# EAGLE design working (EAGLE 6.5.0)
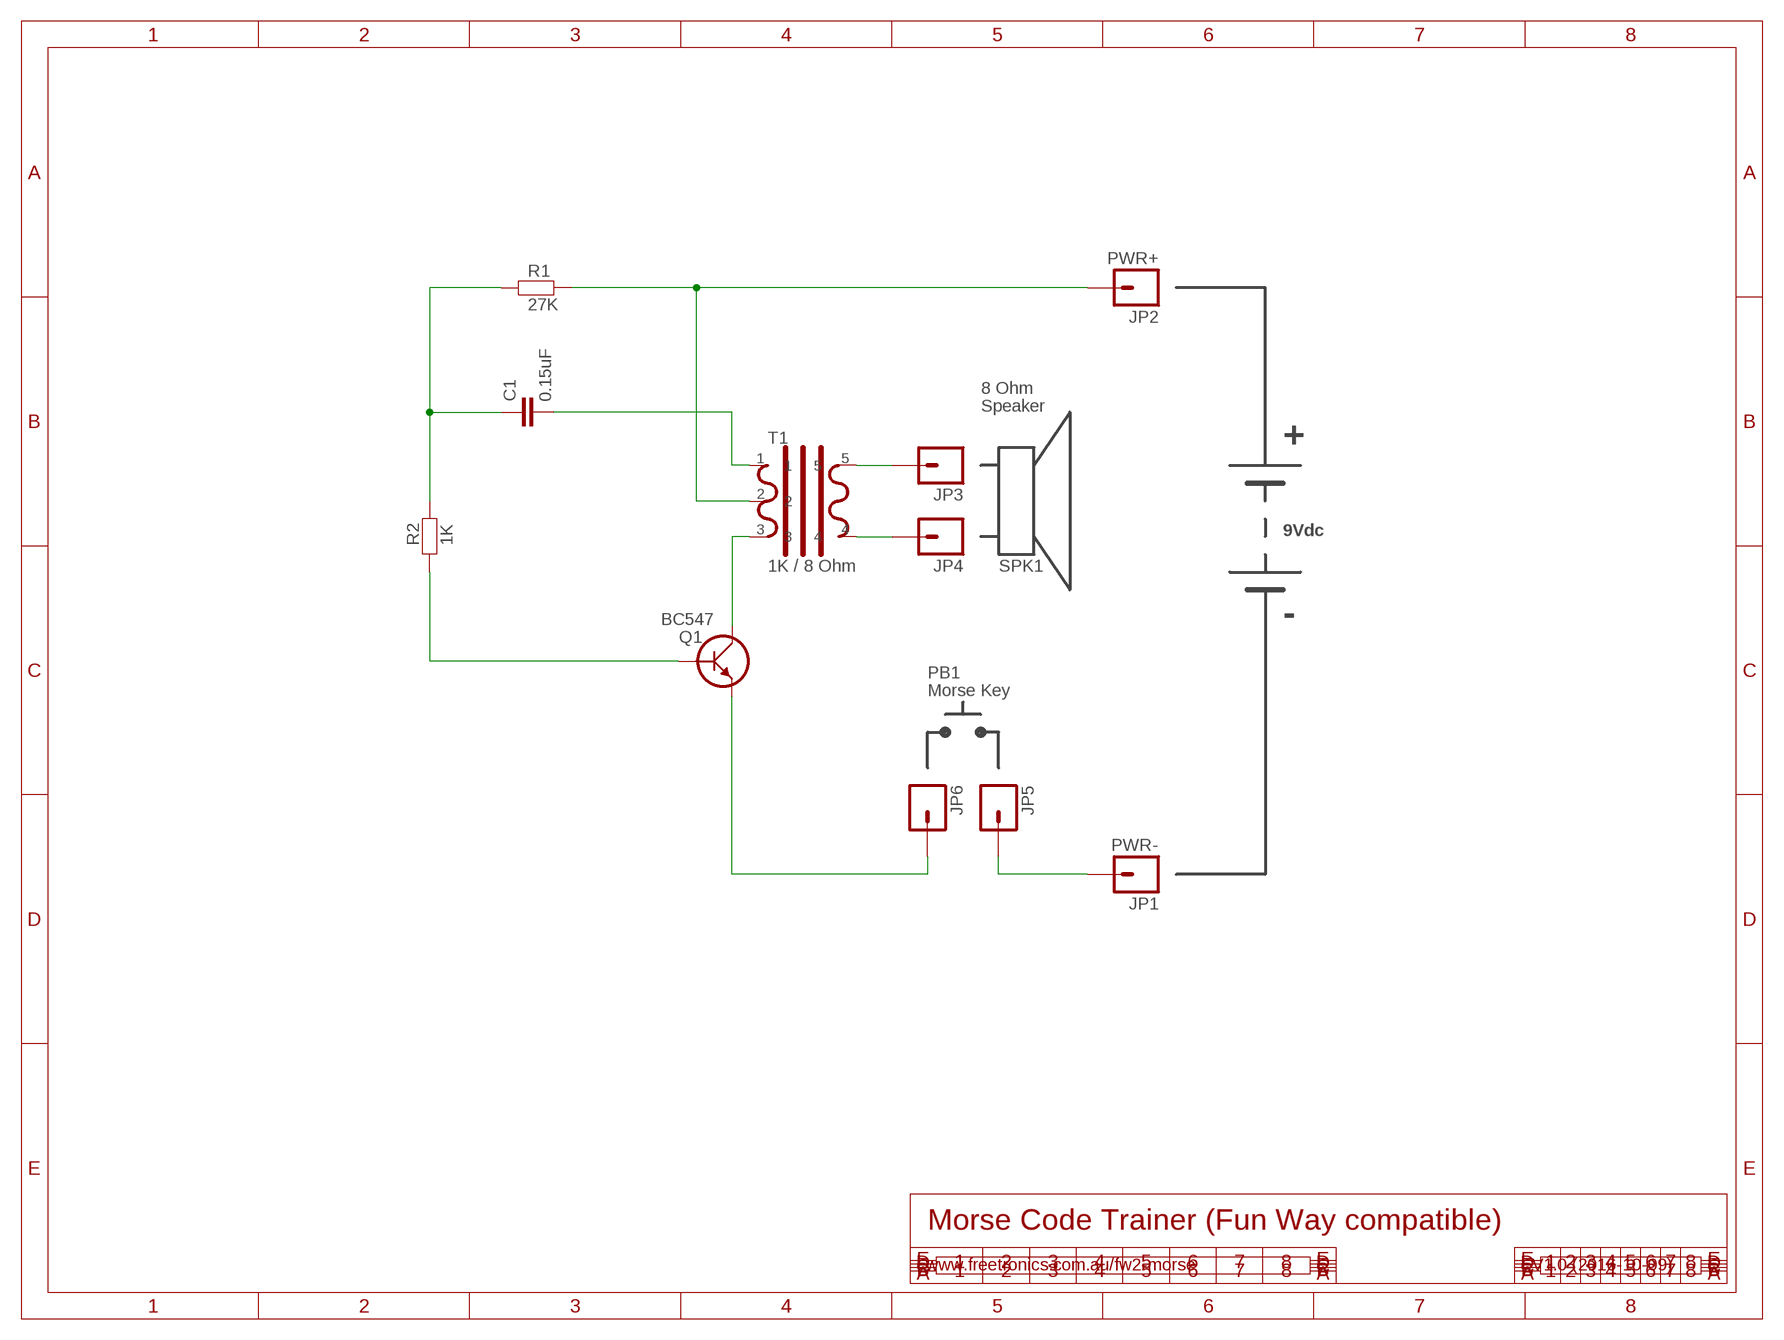
[diagram p0: schematic, sheet 1]

## Parts
C1  0.15uF  CAPPTH  [CAP-PTH-SMALL]
JP1  PWR-  M01PTH  [1X01]
JP2  PWR+  M01PTH  [1X01]
JP3  SPKR+  M01PTH  [1X01]
JP4  SPKR-  M01PTH  [1X01]
JP5  PWR-  M01PTH  [1X01]
JP6  PWR-  M01PTH  [1X01]
Q1  BC547  [TO-92]
R1  27K  FREETRONICS_RESISTORPTH2  [FREETRONICS_AXIAL-0.4]
R2  1K  FREETRONICS_RESISTORPTH2  [FREETRONICS_AXIAL-0.4]
T1  1K / 8 Ohm  AUDIOTRANS  [TRANS350MW]

## Nets
N$1: JP4.1 T1.4
N$2: JP3.1 T1.5
N$3: JP2.1 R1.P$2 T1.2
N$5: C1.2 T1.1
N$6: Q1.1(C) T1.3
N$7: JP1.1 JP5.1
N$8: JP6.1 Q1.3(E)
N$9: Q1.2(B) R2.P$1
N$10: C1.1 R1.P$1 R2.P$2

## Notes on the sheet
- 8 Ohm
- Speaker
- +
- 9Vdc
- SPK1
- -
- PB1
- Morse Key
- Morse Code Trainer (Fun Way compatible)
- www.freetronics.com.au/fw2-morse | V1.0 (2016-10-09)

## Library data of the parts
C1 = freetronics-2:CAP: Capacitor Standard 0603 ceramic capacitor, and 0.1" leaded capacitor.
JP1-JP6 = freetronics-master-v1.1:M01: Header 1 Standard 1-pin 0.1" header. Use with straight break away headers (SKU : PRT-00116), right angle break away headers (PRT-00553), swiss pins (PRT-00743), machine pins (PRT-00117), and female headers (PRT-00115).
Q1 = freetronics-master-v1.1:BC547
R1 R2 = freetronics:FREETRONICS_RESISTOR: Resistor Basic schematic elements and footprints for 0603, 1206, and PTH 1/10th watt (small) resistors.
T1 = freetronics-jon:AUDIOTRANS

## Board
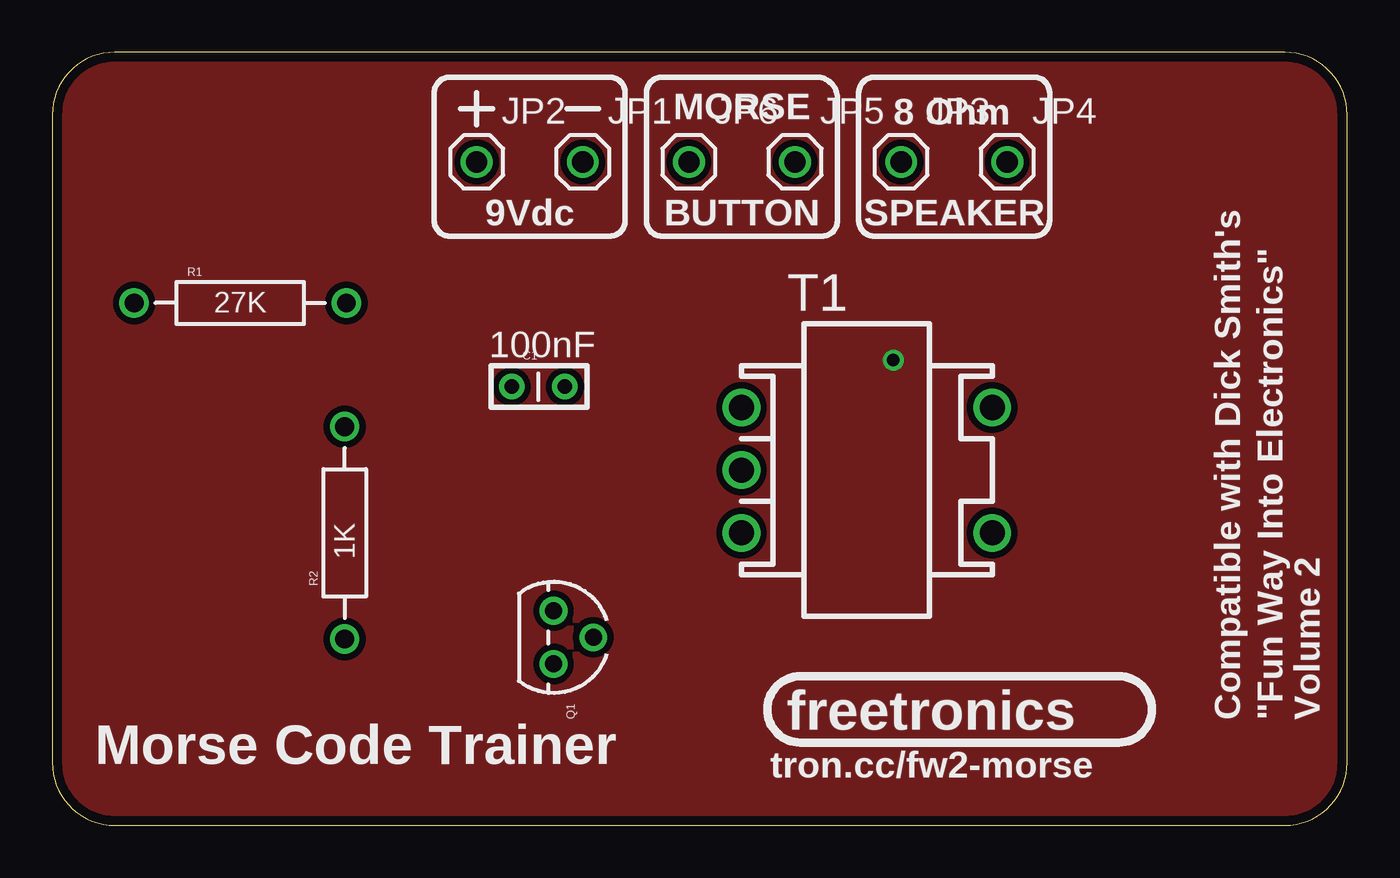
[diagram p1: board, top side]
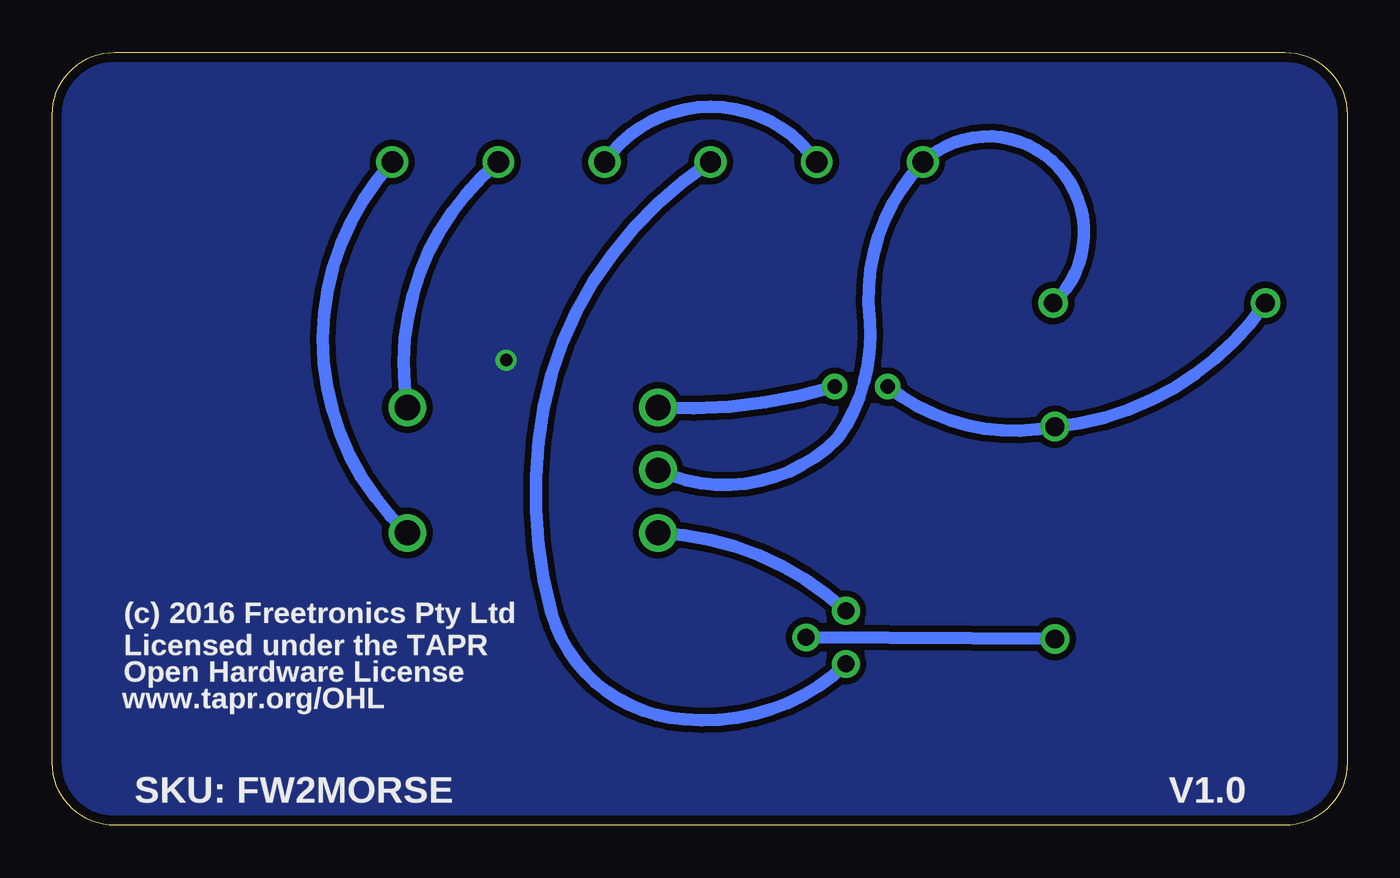
[diagram p2: board, bottom side, seen from below]

Size 62 x 37 mm. Coordinates in mm from the lower left corner, seen from the top.
Outline: 0,3 arc90 3,0 59,0 arc90 62,3 62,34 arc90 59,37 3,37 arc90 0,34 0,3
Copper layers (1*16): Top 0.035mm / dielectric 1.5mm / Bottom 0.035mm
Design rules "default *": minimum track width 10mil, minimum drill 24mil, track to track 12mil, track to pad 12mil, pad to pad 12mil, via to via 12mil, smd to smd 8mil, copper to edge 18mil, drill to drill 8mil, minimum pad ring 10mil, minimum via ring 8mil, stop-mask expansion 4mil, vias tented up to drill 25mil, thermal gap 10mil

### Footprints (pad centres in the part's own frame; a part is rotated, then mirrored left to right if it is on the bottom)
CAP-PTH-SMALL = drill 0.7: 1 0,0; 2 2.54,0
1X01 = drill 1.016: 1 0,0
TO-92 = drill 0.813: 1 -1.27,0; 2 0,1.905; 3 1.27,0
FREETRONICS_AXIAL-0.4 = drill 0.9: P$1 -5.08,0; P$2 5.08,0
TRANS350MW = drill 1.2: 1 -6,3; 2 -6,0; 3 -6,-3; 4 6,-3; 5 6,3

### Placement (x,y rotation side)
C1  22,21 0 top
JP1  25.4,31.75 0 top
JP2  20.32,31.75 0 top
JP3  40.64,31.75 0 top
JP4  45.72,31.75 0 top
JP5  35.56,31.75 0 top
JP6  30.48,31.75 0 top
Q1  24,9 270 top
R1  9,25 0 top
R2  14,14 90 top
T1  39,17 0 top

### Tracks (layer width: path | path; a pad name or v marks a point on that pad's centre or on a via)
GND  (via drill 0.6)
  other vias: 40.27,22.27
  pour Bottom: 0,34 arc-90 3,37 59,37 arc-90 62,34 62,3 arc-90 59,0 3,0 arc-90 0,3
  pour Top: 0,34 arc-90 3,37 59,37 arc-90 62,34 62,3 arc-90 59,0 3,0 arc-90 0,3
N$1
  Bottom 0.61: T1.4 arc90 JP4.1
N$2
  Bottom 0.61: T1.5 arc60 JP3.1
N$3
  Bottom 0.61: R1.P$2 arc-180 JP2.1 arc-50 22.86,24.13 arc40 24.38,18.54 arc70 T1.2
N$5
  Bottom 0.61: T1.1 arc-20 C1.2
N$6
  Bottom 0.61: Q1.1 arc-40 T1.3
N$7
  Bottom 0.61: JP1.1 arc-110 JP5.1
N$8
  Bottom 0.61: Q1.3 arc50 31.75,5.08 arc70 38.1,10.16 arc30 38.1,21.59 arc40 JP6.1
N$9
  Bottom 0.61: Q1.2 R2.P$1
N$10
  Bottom 0.61: C1.1 arc-50 R2.P$2 arc-50 R1.P$1

### Text on the board
tPlace: MORSE | 8 Ohm | 9Vdc | BUTTON | SPEAKER | 100nF | freetronics | Compatible with Dick Smith's | "Fun Way Into Electronics" | Volume 2 | Morse Code Trainer | tron.cc/fw2-morse
bPlace: (c) 2016 Freetronics Pty Ltd | Licensed under the TAPR | Open Hardware License | www.tapr.org/OHL | V1.0 | SKU: FW2MORSE